# Altium schematic sheet CONNECTORS.SchDoc
size A3; Revision: 7
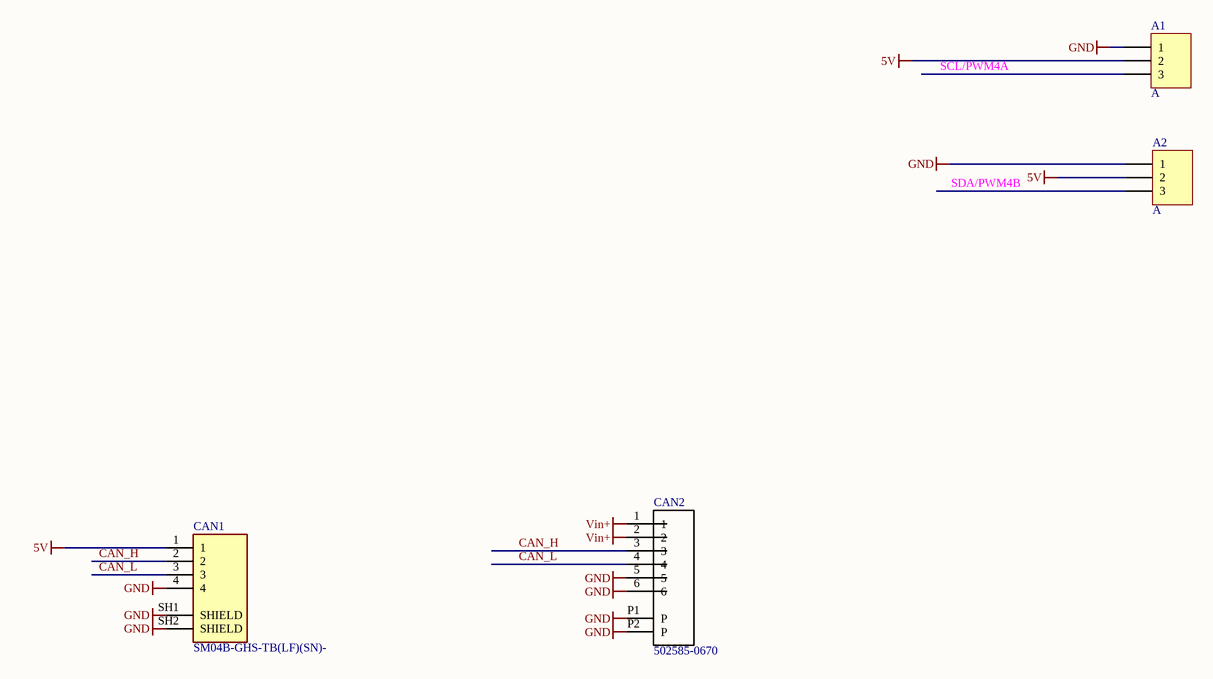
[diagram p0: CONNECTORS.SchDoc]

## Parts
A1  A  [HDR Side 3 pin]
A2  A  [HDR Side 3 pin]
CAN1  SM04B-GHS-TB(LF)(SN)-  [JST_SM04B-GHS-TB(LF)(SN)-]
CAN2  502585-0670  [MOLEX_502585-0670]

## Nets
5V: A1.2 A2.2 CAN1.1
GND: A1.1 A2.1 CAN1.4 CAN1.SH1(SHIELD) CAN1.SH2(SHIELD) CAN2.5 CAN2.6 CAN2.P1(P) CAN2.P2(P)
Vin+: CAN2.1 CAN2.2
CAN_H: CAN1.2 CAN2.3
CAN_L: CAN1.3 CAN2.4
SCL/PWM4A: A1.3
SDA/PWM4B: A2.3

## Library data of the parts
A1 A2 = Header 3: Header, 4-Pin; System: Connector; MF: Connfly electronic (Zhenqin); MP: PLS-3 (DS1021-1x3); Type: SMD; ChipDip_Link: https://www.chipdip.ru/product/pls-3; HelpURL: https://static.chipdip.ru/lib/227/DOC000227157.pdf
CAN1 = SM04B-GHS-TB(LF)(SN)-: Connector Header Surface Mount, Right Angle 4 position 0.049 _1.25mm_; MP: SM04B-GHS-TB_LF__SN_-; MF: JST Sales; Availability: Unavailable; Package: None; Value: *; Price: None; SnapEDA_Link: https://www.snapeda.com/parts/SM04B-GHS-TB%28LF%29%28SN%29-/JST%20Sales%20America%20Inc./view-part/2759740/?ref=snap; HelpURL: http://www.farnell.com/datasheets/2082975.pdf; System: Connector; ChipDip_Link: https://www.chipdip.ru/product/sm04b-ghs-tb-lf-sn-gh-1.25mm-header-side-ent
CAN2 = 502585-0670: 1.50mm Pitch, CLIK-Mate PCB Receptacle, Single Row, Surface Mount, Right-Angle, Tin Plating, Positive Lock, 6 Circuits, Natural; MP: 502494-0670; MF: Molex; System: Connector; Availability: Unavailable; Package: None; SnapEDA_Link: https://www.snapeda.com/parts/502494-0670/Molex/view-part/?ref=snap; Price: None; Value: *